# Altium schematic sheet 顶层8088.SchDoc
size A4
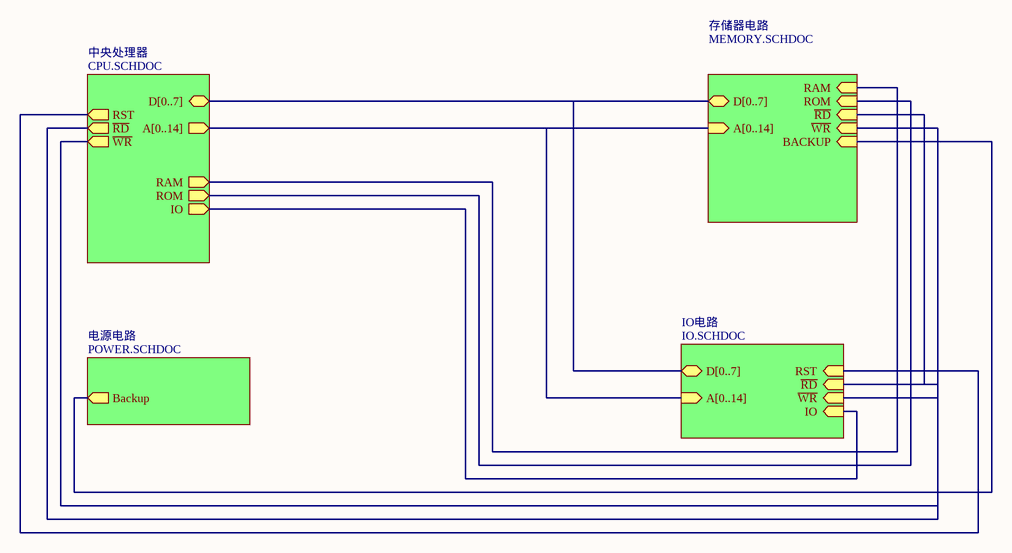
[diagram p0: 顶层8088.SchDoc]

## Sub-sheets
IO电路 = IO.SCHDOC: D[0..7] (bidir), A[0..14] (in), RST (in), ~{RD} (in), ~{WR} (in), IO (in)
中央处理器 = CPU.SCHDOC: RST (out), ~{RD} (out), ~{WR} (out), D[0..7] (bidir), A[0..14] (out), RAM (out), ROM (out), IO (out)
存储器电路 = MEMORY.SCHDOC: D[0..7] (bidir), A[0..14] (in), RAM (in), ROM (in), ~{RD} (in), ~{WR} (in), BACKUP (in)
电源电路 = POWER.SCHDOC: Backup (out)

## Nets
(unnamed): sheet 中央处理器/RST, sheet IO电路/RST
(unnamed): sheet 中央处理器/~{RD}, sheet 中央处理器/~{WR}, sheet 存储器电路/~{RD}, sheet 存储器电路/~{WR}, sheet IO电路/~{RD}, sheet IO电路/~{WR}
(unnamed): sheet 中央处理器/D[0..7], sheet 存储器电路/D[0..7], sheet IO电路/D[0..7]
(unnamed): sheet 中央处理器/A[0..14], sheet 存储器电路/A[0..14], sheet IO电路/A[0..14]
(unnamed): sheet 中央处理器/RAM, sheet 存储器电路/RAM
(unnamed): sheet 中央处理器/ROM, sheet 存储器电路/ROM
(unnamed): sheet 中央处理器/IO, sheet IO电路/IO
(unnamed): sheet 存储器电路/BACKUP, sheet 电源电路/Backup